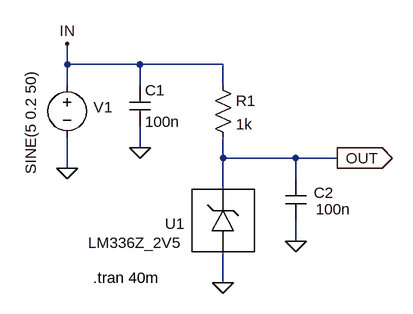
[diagram p0: schematic v2.0.asc]
v2.0.asc, the LTspice schematic file:
Version 4.1
SHEET 1 880 680
WIRE -48 -48 -48 -80
WIRE 64 -48 -48 -48
WIRE 192 -48 64 -48
WIRE -48 -16 -48 -48
WIRE 64 -16 64 -48
WIRE 192 -16 192 -48
WIRE 64 80 64 48
WIRE 192 96 192 64
WIRE 304 96 192 96
WIRE 368 96 304 96
WIRE -48 112 -48 64
WIRE 304 128 304 96
WIRE 192 144 192 96
WIRE 304 224 304 192
WIRE 192 288 192 240
FLAG 192 288 0
FLAG -48 112 0
FLAG 368 96 OUT
IOPIN 368 96 Out
FLAG 304 224 0
FLAG 64 80 0
FLAG -48 -80 IN
SYMBOL voltage -48 -32 R0
WINDOW 0 41 50 Left 2
WINDOW 3 -56 -6 VRight 2
WINDOW 123 0 0 Left 0
WINDOW 39 0 0 Left 0
SYMATTR InstName V1
SYMATTR Value SINE(5 0.2 50)
SYMBOL res 176 -32 R0
SYMATTR InstName R1
SYMATTR Value 1k
SYMBOL cap 288 128 R0
WINDOW 0 44 21 Left 2
WINDOW 3 47 47 Left 2
SYMATTR InstName C2
SYMATTR Value 100n
SYMBOL MyLib\\Regulator\\LM336Z_2V5 192 192 R0
WINDOW 0 -89 5 Left 2
WINDOW 38 -208 34 Left 2
SYMATTR InstName U1
SYMBOL cap 48 -16 R0
SYMATTR InstName C1
SYMATTR Value 100n
TEXT -8 280 Left 2 !.tran 40m

The netlist it stands for:
* v2.0.asc
V1 IN 0 SINE(5 0.2 50)
R1 IN OUT 1k
C2 OUT 0 100n
X§U1 0 OUT LM336Z_2V5  ; pins ANODE CATHODE
C1 IN 0 100n
.tran 40m
.lib MyLib/Regulator/LM336Z_2V5.lib
.backanno
.end

* Results of the author's LTspice run, read from the files saved beside the schematic
* Operating Point, zero values left out:
*   V(in) = 5 V
*   V(out) = 2.491 V
*   I(R1) = 2.509 mA
*   I(V1) = -2.509 mA
*   Ix(u1:1) = 2.509 mA
*   Ix(u1:2) = -2.509 mA
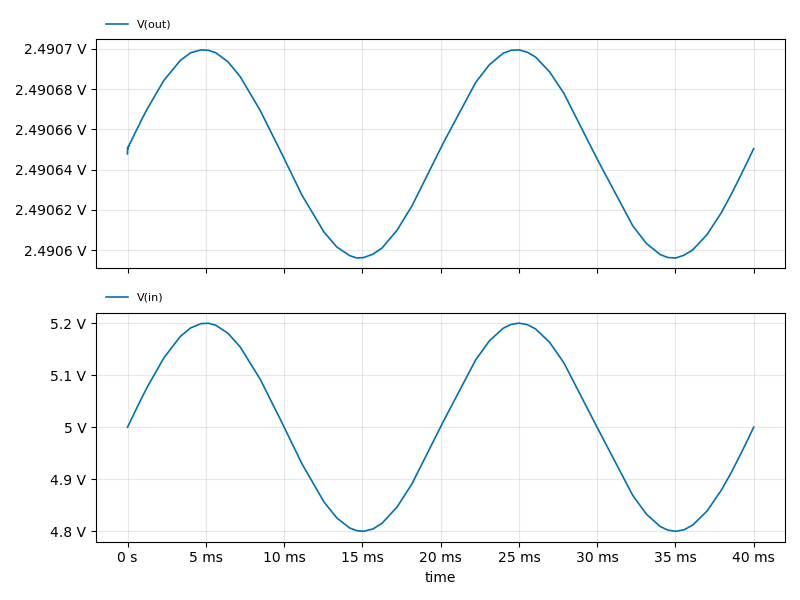
[diagram p1: Transient Analysis of v2.0.asc, plotted from the saved traces]
* Transient Analysis, 1 run:
*   V(out): min 2.491 V, max 2.491 V, average 2.491 V, rms 2.491 V, last 2.491 V
*   V(in): min 4.8 V, max 5.2 V, average 5 V, rms 5.002 V, last 5 V